# Altium schematic sheet Boost_stage_power_stage.SchDoc
size A4
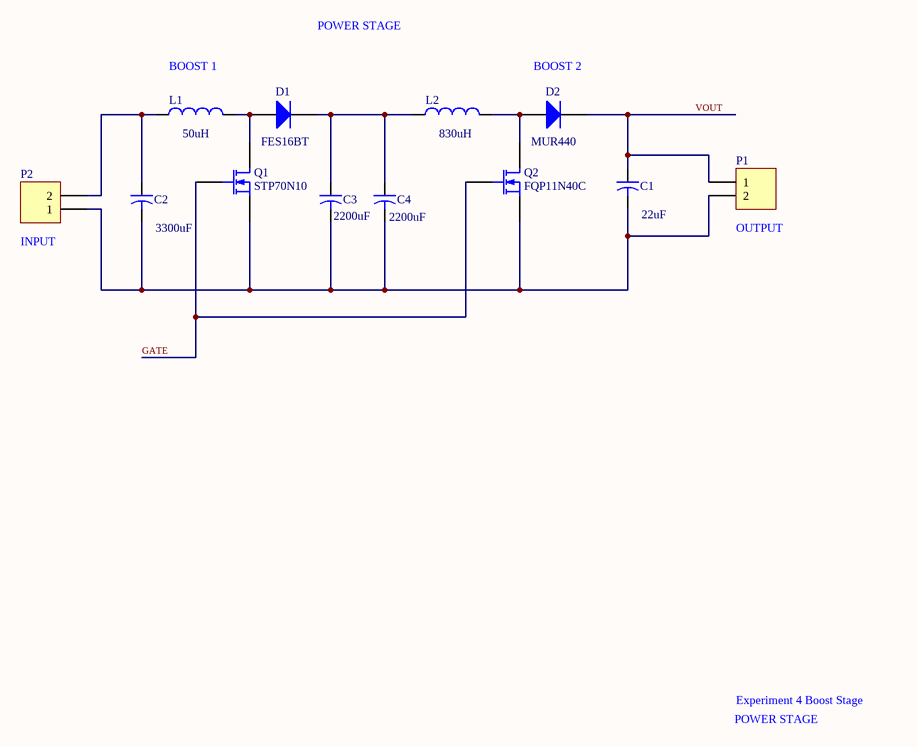
[diagram p0: Boost_stage_power_stage.SchDoc]

## Parts
C1  value 22uF  [CAPR5-4X5]  (hidden comment: Cap2)
C2  value 3300uF  [CAPR5-4X5]  (hidden comment: Cap2)
C3  value 2200uF  [CAPR5-4X5]  (hidden comment: Cap2)
C4  value 2200uF  [CAPR5-4X5]  (hidden comment: Cap2)
D1  FES16BT  [SMC]
D2  MUR440  [SMC]
L1  value 50uH  [0402-A]  (hidden comment: Inductor)
L2  value 830uH  [0402-A]  (hidden comment: Inductor)
P1  Header 2  [HDR1X2]  (value not drawn)
P2  Header 2  [HDR1X2]  (value not drawn)
Q1  STP70N10  [E3]
Q2  FQP11N40C  [E3]

## Nets
GATE: Q1.2(G) Q2.2(G)
VOUT: C1.1 D2.2(K) P1.1
NetC1_2: C1.2 C2.2 C3.2 C4.2 P1.2 P2.1 Q1.3(S) Q2.3(S)
NetC2_1: C2.1 L1.1 P2.2
NetC3_1: C3.1 C4.1 D1.2(K) L2.1
NetD1_1: D1.1(A) L1.2 Q1.1(D)
NetD2_1: D2.1(A) L2.2 Q2.1(D)

## Notes on the sheet
- POWER STAGE
- (near L1) BOOST 1
- (near D2) BOOST 2
- (near P2) INPUT
- (near P1) OUTPUT
- Experiment 4 Boost Stage

## Library data of the parts
C1-C4 = Cap2: Capacitor; Published: 23-Sep-2002; PackageReference: CAPR5-4X5; Publisher: Altium Limited; PackageDescription: Capacitor; 2 Leads
D1 D2 = Diode: Default Diode; Published: 8-Jun-2000; LatestRevisionDate: 17-Jul-2002; LatestRevisionNote: Re-released for DXP Platform.; PackageVersion: Sep-1996; PackageReference: SMC; Publisher: Altium Limited; PackageDescription: DO-214-AB/SMC; 2 C-Bend Leads; Body 7.9 x 5.9 mm, inc. leads (LxW); Code_JEDEC: DO-214-AB
L1 L2 = Inductor: Code_IEC: 1005; Published: 8-Jun-2000; LatestRevisionDate: 29-May-2009; LatestRevisionNote: IPC-7351 Footprint Added.; PackageReference: 0402-A; Publisher: Altium Limited; PackageDescription: Chip Inductor; Code_JEITA: 0402
P1 P2 = Header 2: Header, 2-Pin; LatestRevisionDate: 17-Jul-2002; LatestRevisionNote: Re-released for DXP Platform.; Publisher: Altium Limited
Q1 Q2 = MOSFET-N: N-Channel MOSFET; Published: 8-Jun-2000; LatestRevisionDate: 17-Jul-2002; LatestRevisionNote: Re-released for DXP Platform.; PackageVersion: 1995/1996; PackageReference: E3; Publisher: Altium Limited; PackageDescription: TO, Flat Index; 3 In-Line, Axial Leads; Body Dia. 4.6mm; Lead Dia. 0.5 mm (max)